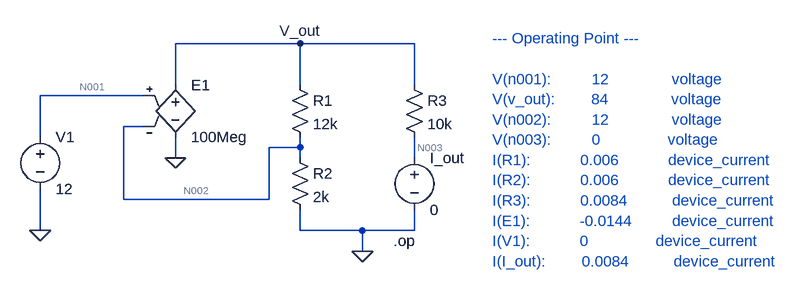
[diagram p0: schematic Q1.asc]
Q1.asc, the LTspice schematic file:
Version 4
SHEET 1 1148 680
WIRE 368 -64 176 -64
WIRE 544 -64 368 -64
WIRE 176 0 176 -64
WIRE 368 0 368 -64
WIRE 544 0 544 -64
WIRE 128 16 -32 16
WIRE 128 64 96 64
WIRE -32 80 -32 16
WIRE 368 96 368 80
WIRE 368 96 320 96
WIRE 176 112 176 80
WIRE 368 112 368 96
WIRE 544 112 544 80
WIRE 96 176 96 64
WIRE 320 176 320 96
WIRE 320 176 96 176
WIRE -32 224 -32 160
WIRE 368 224 368 192
WIRE 464 224 368 224
WIRE 544 224 544 192
WIRE 544 224 464 224
WIRE 464 256 464 224
FLAG 176 112 0
FLAG -32 224 0
FLAG 464 256 0
FLAG 368 -64 V_out
SYMBOL voltage -32 64 R0
SYMATTR InstName V1
SYMATTR Value 12
SYMBOL e 176 -16 R0
SYMATTR InstName E1
SYMATTR Value 100Meg
SYMBOL res 352 -16 R0
SYMATTR InstName R1
SYMATTR Value 12k
SYMBOL res 352 96 R0
SYMATTR InstName R2
SYMATTR Value 2k
SYMBOL res 528 -16 R0
SYMATTR InstName R3
SYMATTR Value 10k
SYMBOL voltage 544 96 R0
SYMATTR InstName I_out
SYMATTR Value 0
TEXT 512 240 Left 2 !.op
TEXT 664 -72 Left 2 ;--- Operating Point ---\n \nV(n001):         12              voltage\nV(v_out):        84              voltage\nV(n002):         12              voltage\nV(n003):         0               voltage\nI(R1):           0.006           device_current\nI(R2):           0.006           device_current\nI(R3):           0.0084          device_current\nI(E1):           -0.0144         device_current\nI(V1):           0               device_current\nI(I_out):        0.0084          device_current

The netlist it stands for:
* Q1.asc
V1 N001 0 12
E1 V_out 0 N001 N002 100Meg
R1 V_out N002 12k
R2 N002 0 2k
R3 V_out N003 10k
V§I_out N003 0 0
.op
* --- Operating Point ---
* V(n001):         12              voltage
* V(v_out):        84              voltage
* V(n002):         12              voltage
* V(n003):         0               voltage
* I(R1):           0.006           device_current
* I(R2):           0.006           device_current
* I(R3):           0.0084          device_current
* I(E1):           -0.0144         device_current
* I(V1):           0               device_current
* I(I_out):        0.0084          device_current
.backanno
.end

* Results of the author's LTspice run, read from the files saved beside the schematic
* Operating Point:
*   V(n001) = 12 V
*   V(v_out) = 84 V
*   V(n002) = 12 V
*   V(n003) = 0 V
*   I(R1) = 6 mA
*   I(R2) = 6 mA
*   I(R3) = 8.4 mA
*   I(E1) = -14.4 mA
*   I(V1) = 0 A
*   I(I_out) = 8.4 mA